# EAGLE design VUSB_BREAKOUT_V1 (EAGLE 8.7.0)
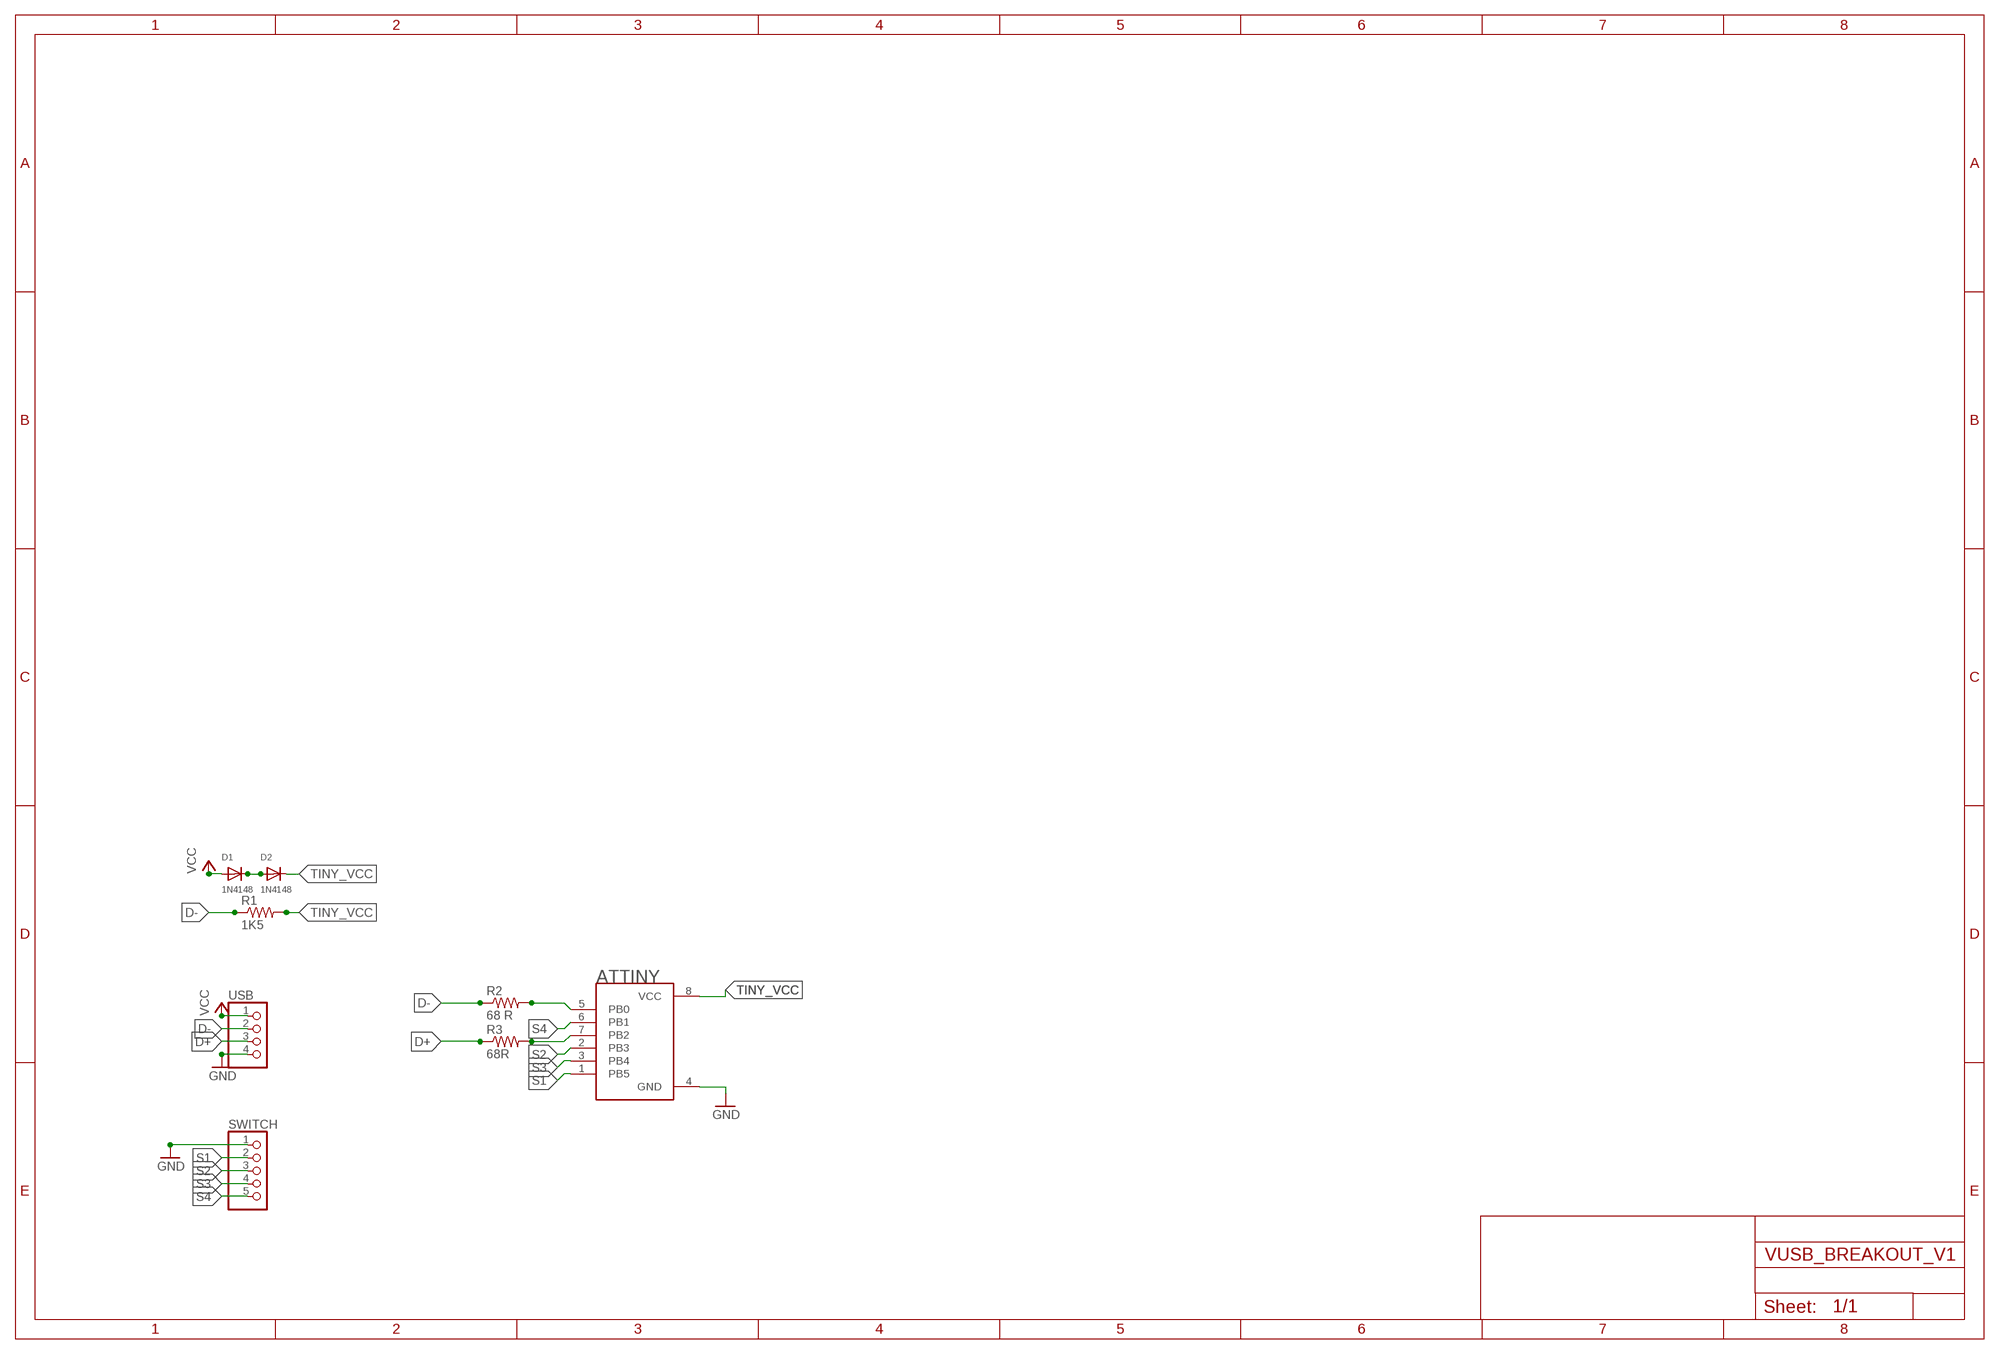
[diagram p0: schematic, sheet 1]

## Parts
ATTINY  ATTINY85-20PU  [DIP762W46P254L927H533Q8B]
D1  1N4148  DIODEDO-1N4148  [DO-1N4148]
D2  1N4148  DIODEDO-1N4148  [DO-1N4148]
R1  1K5  R-US_0207/15  [0207/15]
R2  68 R  R-US_0207/15  [0207/15]
R3  68R  R-US_0207/15  [0207/15]
SWITCH  PINHD-1X5  [1X05]
USB  PINHD-1X4  [1X04]

## Nets
D+: R3.1 USB.3
D-: R1.1 R2.1 USB.2
GND: ATTINY.4(GND) SWITCH.1 USB.4
N$2: ATTINY.5(PB0) R2.2
N$3: D1.C D2.A
N$4: ATTINY.7(PB2) R3.2
S1: ATTINY.1(PB5) SWITCH.2
S2: ATTINY.2(PB3) SWITCH.3
S3: ATTINY.3(PB4) SWITCH.4
S4: ATTINY.6(PB1) SWITCH.5
TINY_VCC: ATTINY.8(VCC) D2.C R1.2
VCC: D1.A USB.1

## Library data of the parts
ATTINY = ATTINY85-20PU:ATTINY85-20PU: ATtiny Series 20 MHz 8 KB Flash 512 B SRAM 8-Bit Microcontroller - DIP-8; AVAILABILITY: Good; DESCRIPTION: ATtiny Series 20 MHz 8 KB Flash 512 B SRAM 8-Bit Microcontroller - DIP-8; MF: Microchip; MP: ATTINY85-20PU; PACKAGE: DIP-8 Microchip; PRICE: 1.31 USD
D1 D2 = adafruit:DIODE: Diode SMADIODE - SMA Surface Mount Package 20V 1A Schottky Diode Digikey: 641-1014-6-ND DO-1N4148 - Through Hole Small Current Diode SOD-123 20V 1 A (.5mV Vf) Schottky Diode - Digikey: MBRX120TPMSCT-ND SOD-323 10V 570mA (.38mV Vf, 3ns) Schottky Diode - Digikey: ZLLS410CT-ND SOD-523 30V 30mA Schottky Diode (RB751S-40TE61) - Digikey: RB751S-40TE61CT-ND SOT23-R/W - SOT23 Package (R = Solder Paste/Reflow Ovens, W = Hand-Soldering) BAT54Film 40V 300mA - Digikey: 497-7162-1-ND
R1-R3 = rcl:R-US_: RESISTOR, American symbol; SPICEPREFIX: R
SWITCH = pinhead:PINHD-1X5: PIN HEADER
USB = pinhead:PINHD-1X4: PIN HEADER

## Board
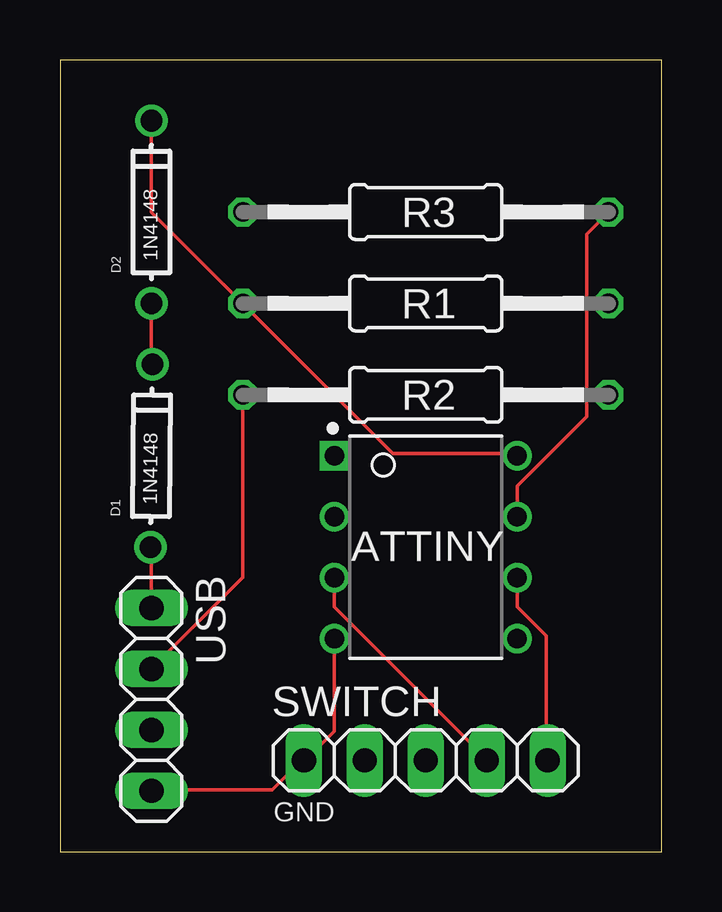
[diagram p1: board, top side]
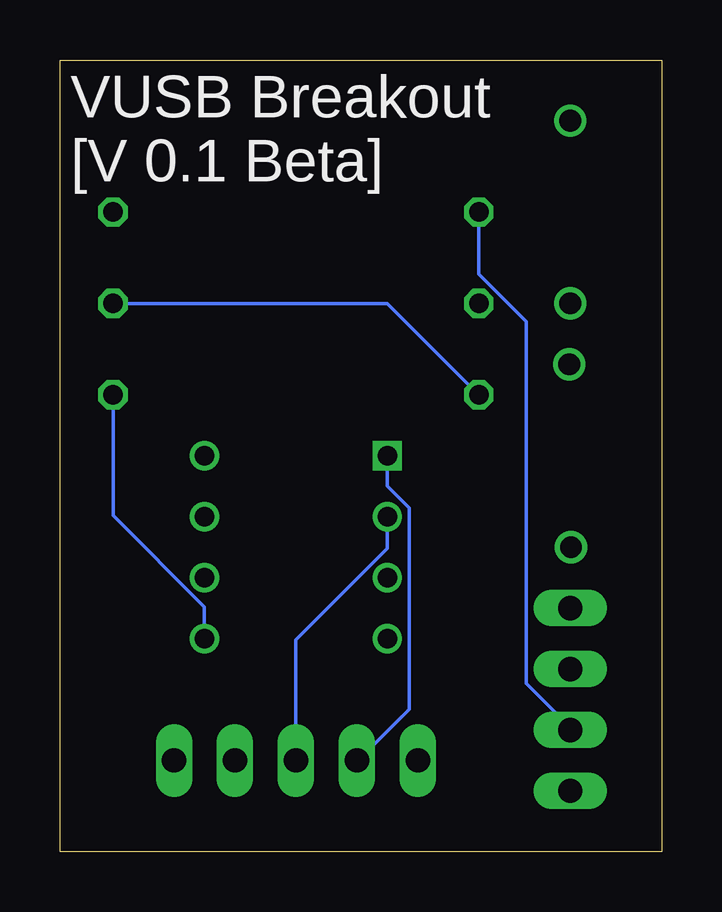
[diagram p2: board, bottom side, seen from below]

Size 25.07 x 33.01 mm. Coordinates in mm from the lower left corner, seen from the top.
Outline: 0,0 25.07,0 25.07,33.01 0,33.01 0,0
Copper layers (1*16): Top 0.035559375mm / dielectric 1.6mm / Bottom 0.035559375mm
Design rules "oshpark-2layer": minimum track width 6mil, minimum drill 10mil, track to track 6mil, track to pad 6mil, pad to pad 6mil, via to via 6mil, smd to smd 6mil, copper to edge 15mil, drill to drill 6mil, minimum pad ring 5mil, minimum via ring 5mil, stop-mask expansion 2.5mil, vias tented up to drill 0mil, thermal gap 10mil

### Footprints (pad centres in the part's own frame; a part is rotated, then mirrored left to right if it is on the bottom)
DIP762W46P254L927H533Q8B = drill 0.813 square: 1 -3.81,3.81 | drill 0.813: 2 -3.81,1.27; 3 -3.81,-1.27; 4 -3.81,-3.81; 5 3.81,-3.81; 6 3.81,-1.27; 7 3.81,1.27; 8 3.81,3.81
DO-1N4148 = drill 0.9: A -3.81,0; C 3.81,0
0207/15 = drill 0.813 octagon: 1 -7.62,0; 2 7.62,0
1X05 = drill 1.016 long: 1 -5.08,0; 2 -2.54,0; 3 0,0; 4 2.54,0; 5 5.08,0
1X04 = drill 1.016 long: 1 -3.81,0; 2 -1.27,0; 3 1.27,0; 4 3.81,0

### Placement (x,y rotation side)
ATTINY  15.24,12.7 0 top
D1  3.81,16.51 89.4 top
D2  3.81,26.67 90 top
R1  15.24,22.86 180 top
R2  15.24,19.05 0 top
R3  15.24,26.67 0 top
SWITCH  15.24,3.81 0 top
USB  3.81,6.35 270 top

### Tracks (layer width: path | path; a pad name or v marks a point on that pad's centre or on a via)
D+
  Bottom 0.152: R3.1 7.62,24.08 5.64,22.1 5.64,7.01 3.81,5.18 USB.3
D-
  Top 0.152: R2.1 7.62,11.43 USB.2
  Bottom 0.152: R1.1 11.43,22.86 R2.1
GND
  Top 0.152: ATTINY.4 11.43,5.03 10.21,3.81 SWITCH.1 10.06,3.81 8.84,2.59 3.81,2.59 USB.4
N$2
  Bottom 0.152: ATTINY.5 19.05,10.21 22.86,14.02 R2.2
N$3
  Top 0.152: D2.A 3.81,20.42 D1.C
N$4
  Top 0.152: ATTINY.7 19.05,15.24 21.95,18.14 21.95,25.76 R3.2
S1
  Bottom 0.152: ATTINY.1 11.43,15.24 10.52,14.33 10.52,5.94 12.65,3.81 SWITCH.2
S2
  Bottom 0.152: ATTINY.2 11.43,12.65 15.24,8.84 SWITCH.3
S3
  Top 0.152: ATTINY.3 11.43,10.21 17.83,3.81 SWITCH.4
S4
  Top 0.152: ATTINY.6 19.05,10.21 20.27,8.99 20.27,3.81 SWITCH.5
TINY_VCC
  Top 0.152: ATTINY.8 19.05,16.61 13.87,16.61 R1.2 3.81,26.67 D2.C
VCC
  Top 0.152: USB.1 3.81,12.65 D1.A

### Text on the board
tPlace: GND
bPlace: VUSB Breakout / [V 0.1 Beta]